# Altium schematic sheet MODULIQ_ADC_10Vpp.SchDoc: ADC 0-10V
size A3; Author: M.Beldyga; CompanyName: WUT ISE; DrawnBy: M.Beldyga; Organization: WUT ISE; Address1: PW ISE; Address2: Nowowiejska 15/19 00-665 Warsaw; Address3: micbeldyga@gmail.com; SheetNumber: 1; SheetTotal: 2; ModifiedBy: -; CheckedDate: -; Title2: MODULIQ; DivGrp: WUT ISE; Designer: M.Beldyga; ModifiedDate: -; ProjectName: Sensor Box
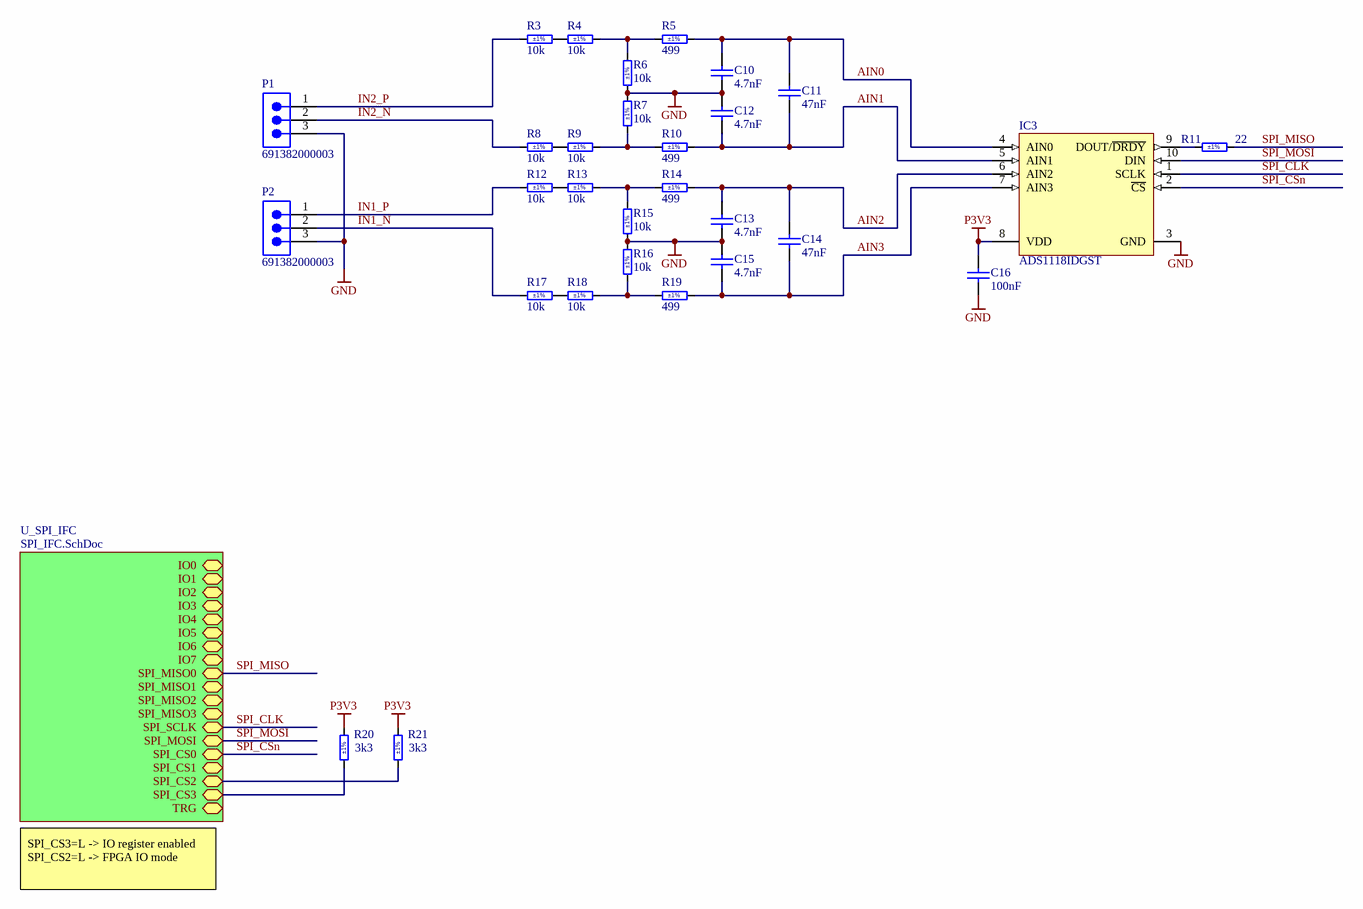
[diagram p0: MODULIQ_ADC_10Vpp.SchDoc]

## Parts
C10  4.7nF  [CAPC1005X55N]
C11  47nF  [CAPC1005X55N]
C12  4.7nF  [CAPC1005X55N]
C13  4.7nF  [CAPC1005X55N]
C14  47nF  [CAPC1005X55N]
C15  4.7nF  [CAPC1005X55N]
C16  100nF  [CAPC1005X55N]
IC3  ADS1118IDGST  [SOP50P490X110-10N]
P1  691382000003  [691382000003]
P2  691382000003  [691382000003]
R3  10k  Tolerance: ±1%  [RESC1005X40N]
R4  10k  Tolerance: ±1%  [RESC1005X40N]
R5  499  Tolerance: ±1%  [RESC1005X40N]
R6  10k  Tolerance: ±1%  [RESC1005X40N]
R7  10k  Tolerance: ±1%  [RESC1005X40N]
R8  10k  Tolerance: ±1%  [RESC1005X40N]
R9  10k  Tolerance: ±1%  [RESC1005X40N]
R10  499  Tolerance: ±1%  [RESC1005X40N]
R11  22  Tolerance: ±1%  [RESC1005X40N]
R12  10k  Tolerance: ±1%  [RESC1005X40N]
R13  10k  Tolerance: ±1%  [RESC1005X40N]
R14  499  Tolerance: ±1%  [RESC1005X40N]
R15  10k  Tolerance: ±1%  [RESC1005X40N]
R16  10k  Tolerance: ±1%  [RESC1005X40N]
R17  10k  Tolerance: ±1%  [RESC1005X40N]
R18  10k  Tolerance: ±1%  [RESC1005X40N]
R19  499  Tolerance: ±1%  [RESC1005X40N]
R20  3k3  Tolerance: ±1%  [RESC1005X40N]
R21  3k3  Tolerance: ±1%  [RESC1005X40N]

## Sub-sheets
U_SPI_IFC = SPI_IFC.SchDoc: IO0 (bidir), IO1 (bidir), IO2 (bidir), IO3 (bidir), IO4 (bidir), IO5 (bidir), IO6 (bidir), IO7 (bidir), SPI_MISO0 (bidir), SPI_MISO1 (bidir), SPI_MISO2 (bidir), SPI_MISO3 (bidir), SPI_SCLK (bidir), SPI_MOSI (bidir), SPI_CS0 (bidir), SPI_CS1 (bidir), SPI_CS2 (bidir), SPI_CS3 (bidir), TRG (bidir)

## Nets
GND: C10.1 C12.2 C13.1 C15.2 C16.1 IC3.3(GND) P1.3 P2.3 R6.1 R7.2 R15.1 R16.2
P3V3: C16.2 IC3.8(VDD) R20.1 R21.1
AIN0: C10.2 C11.2 IC3.4(AIN0) R5.2
AIN1: C11.1 C12.1 IC3.5(AIN1) R10.2
AIN2: C13.2 C14.2 IC3.6(AIN2) R14.2
AIN3: C14.1 C15.1 IC3.7(AIN3) R19.2
IN1_N: P2.2 R17.2
IN1_P: P2.1 R12.2
IN2_N: P1.2 R8.2
IN2_P: P1.1 R3.2
SPI_CLK: IC3.1(SCLK) ; sheet U_SPI_IFC/SPI_SCLK
SPI_CSn: IC3.2(~{CS}) ; sheet U_SPI_IFC/SPI_CS0
SPI_MISO: R11.2 ; sheet U_SPI_IFC/SPI_MISO0
SPI_MOSI: IC3.10(DIN) ; sheet U_SPI_IFC/SPI_MOSI
NetIC3_9: IC3.9(DOUT/~{DRDY}) R11.1
NetR3_1: R3.1 R4.2
NetR4_1: R4.1 R5.1 R6.2
NetR7_1: R7.1 R9.1 R10.1
NetR8_1: R8.1 R9.2
NetR12_1: R12.1 R13.2
NetR13_1: R13.1 R14.1 R15.2
NetR16_1: R16.1 R18.1 R19.1
NetR17_1: R17.1 R18.2
NetR20_2: R20.2 ; sheet U_SPI_IFC/SPI_CS3
NetR21_2: R21.2 ; sheet U_SPI_IFC/SPI_CS2

## Notes on the sheet
- SPI_CS3=L -> IO register enabled
  SPI_CS2=L -> FPGA IO mode
- Project/Equipment
- Document
- Designer
- Drawn by
- Check.by
- Contact
- File
- Last Mod.
- Print Date
- Sheet
- Size
- A3
- of
- Rev

## Library data of the parts
C10 C12 C13 C15 = CC0402_4.7NF_16V_10%_X7R: Non-polarised capacitor; Part Description: SMD Multilayer Chip Ceramic Capacitor; Manufacturer: GENERIC; Manufacturer1 Part Number: 223878715632; Voltage: 16V; TC: X7R; Tolerance: ±10%; Part Number: CC0402_4.7NF_16V_10%_X7R; Component Kind: Standard; Component Type: Standard; Pin Count: 2; Value: 4.7nF; Status: Not Recommended; Manufacturer Part Number: CC0402_4.7NF_16V_10%_X7R; Case: 0402; Mounted: Yes; Socket: No; SMD: Yes; Sense: No; Manufacturer1 Example: PHYCOMP; Manufacturer1 ComponentHeight: 0.55mm; HelpURL: \\cern.ch\dfs\Applications\Altium\Datasheets\CC0402_X7R_PHYCOMP.pdf; Author: CERN DEM JLC; CreateDate: 12/3/2007; LatestRevisionDate: 12/3/2007
C11 C14 = CC0402_47NF_25V_10%_X7R: Non-polarised capacitor; Part Description: SMD Multilayer Chip Ceramic Capacitor; Manufacturer: GENERIC; Manufacturer1 Part Number: C1005X7R1E473K050; Voltage: 25V; TC: X7R; Tolerance: ±10%; Part Number: CC0402_47NF_25V_10%_X7R; Component Kind: Standard; Component Type: Standard; Pin Count: 2; Value: 47nF; Status: Preferred; Manufacturer Part Number: CC0402_47NF_25V_10%_X7R; Case: 0402; Mounted: Yes; Socket: No; SMD: Yes; Sense: No; Manufacturer1 Example: TDK; Manufacturer1 ComponentHeight: 0.55mm; HelpURL: \\cern.ch\dfs\Applications\Altium\Datasheets\CC0402_X7R_TDK_C.pdf; Author: CERN DEM JLC; CreateDate: 10/25/2012; LatestRevisionDate: 10/25/2012
C16 = CC0402_100NF_16V_10%_X7R: Non-polarised capacitor; Part Description: SMD Multilayer Chip Ceramic Capacitor; Manufacturer: GENERIC; Manufacturer1 Part Number: GRM155R71C104KA88D; Voltage: 16V; TC: X7R; Tolerance: ±10%; Part Number: CC0402_100NF_16V_10%_X7R; Component Kind: Standard; Component Type: Standard; Pin Count: 2; Value: 100nF; Status: Not Recommended; Manufacturer Part Number: CC0402_100NF_16V_10%_X7R; Case: 0402; Mounted: Yes; Socket: No; SMD: Yes; Sense: No; Manufacturer1 Example: MURATA; Manufacturer1 ComponentHeight: 0.55mm; HelpURL: \\cern.ch\dfs\Applications\Altium\Datasheets\CC0402_X7R_MURATA_GRM.pdf; Author: CERN DEM JLC; CreateDate: 12/5/2013; LatestRevisionDate: 12/3/2007
IC3 = ADS1118IDGST: Quad Channel Single ADC Delta-Sigma 860sps 16-bit Serial 10-Pin VSSOP T/R; Manufacturer: Texas Instruments; Min Supply Voltage: 2V; Max Supply Voltage: 5.5V; Number of Channels: 2; Max Power Dissipation: 900uW; Operating Supply Voltage: 3.3V; Interface: SPI; Number of Bits: 16; Number of Converters: 1; Resolution: 16b; Sampling Rate: 860S/s; Polarity: Bipolar; Integral Nonlinearity (INL): 1LSB; Number of Inputs: 4; Supply Current: 150uA; Supplier: Mouser; Supplier Part Number: 595-ADS1118IDGST; Manufacturer Part Number: ADS1118IDGST; RoHS: Yes; Category: Analog to Digital Converters (ADCs); Stock: 2422; Pricing: 1=6.29, 10=4.83, 25=4.47, 50=4.47, 100=4.07, 250=3.87, 500=3.69, 1000=3.59, 2500=3.5, 10000=3.59 (USD); Case/Package: VSSOP; Pins: 10; Contact Plating: Gold; Min Operating Temperature: -40°C; Max Operating Temperature: 125°C; Package Quantity: 250; Packaging: Tape and Reel; Number of A/D Converters: 1; Number of Elements: 1; Supply Type: Single; Conversion Rate: 860S/s; Max Supply Voltage (DC): 5.5V; Min Supply Voltage (DC): 2V; Power Dissipation: 900uW; Series: -; Length: 3.1mm; Width: 3.1mm; Height: 1.1mm; Thickness: 1.02mm; Reach SVHC Compliant: No; Lead Free: Lead Free; RoHS Compliant: Yes; ComponentLink1URL: https://datasheet.ciiva.com/7989/1634024-7989312.pdf?src-supplier=Element14; ComponentLink1Description: https://datasheet.ciiva.com/7989/1634024-7989312.pdf?src-supplier=Element14; ComponentLink2URL: https://datasheet.ciiva.com/41461/001186694-da-01-en-ic-adc-16bit-sp-ads1118idgst-msop-10-tid-41461012.pdf?src-supplier=Conrad; ComponentLink2Description: https://datasheet.ciiva.com/41461/001186694-da-01-en-ic-adc-16bit-sp-ads1118idgst-msop-10-tid-41461012.pdf?src-supplier=Conrad; ComponentLink3URL: https://datasheet.ciiva.com/1261/ads1118-1261457.pdf?src-supplier=Digikey; ComponentLink3Description: https://datasheet.ciiva.com/1261/ads1118-1261457.pdf?src-supplier=Digikey; ComponentLink4URL: https://datasheet.ciiva.com/1261/ads1118-1261458.pdf?src-supplier=Digikey; ComponentLink4Description: https://datasheet.ciiva.com/1261/ads1118-1261458.pdf?src-supplier=Digikey; ComponentLink5URL: https://datasheet.ciiva.com/1261/ads1118-1261459.pdf?src-supplier=Digikey; ComponentLink5Description: https://datasheet.ciiva.com/1261/ads1118-1261459.pdf?src-supplier=Digikey; ComponentLink6URL: https://datasheet.ciiva.com/14259/ads1118-14259989.pdf?src-supplier=Avnet; ComponentLink6Description: https://datasheet.ciiva.com/14259/ads1118-14259989.pdf?src-supplier=Avnet; ComponentLink7URL: https://datasheet.ciiva.com/46394/1793017-46394506.pdf?src-supplier=Element14; ComponentLink7Description: https://datasheet.ciiva.com/46394/1793017-46394506.pdf?src-supplier=Element14; ComponentLink8URL: https://datasheet.ciiva.com/46394/1793017-46394507.pdf?src-supplier=Element14; ComponentLink8Description: https://datasheet.ciiva.com/46394/1793017-46394507.pdf?src-supplier=Element14
P1 P2 = 691382000003: WR-TBL Series 382 Vertical PCB Header, THT, pitch 2.5mm, 3p; Manufacturer: Wurth Elektronik; Modularity: No; Rated Current: 4A; Working Voltage: 300V; Manufacturer Part Number: 691382000003; Category: Terminal Blocks; Match Code: WR-TBL; ComponentLink1Description: Website Link; ComponentLink1URL: https://www.we-online.com/redexpert/article/691382000003?ad; ComponentLink2Description: Datasheet Link; ComponentLink2URL: https://www.we-online.com/redexpert/spec/691382000003?ad; Mount: Through Hole; Operating Temperature Max: 105°C; Operating Temperature Min: -40°C; Packaging: Box; Application: Pluggable; Number of Pins: 3; Number of Rows: 1; Orientation: Vertical; Pitch: 2.5mm
R3 R4 R6-R9 R12 R13 R15-R18 = R0402_10K_1%_0.0625W_100PPM: Resistor - 1%; Part Description: General Purpose Thick Film Chip Resistor; Manufacturer: GENERIC; Manufacturer1 Part Number: 232270671003L; TC: ±100ppm/°C; PressFit: No; Part Number: R0402_10K_1%_0.0625W_100PPM; Component Kind: Standard; Component Type: Standard; Pin Count: 2; Value: 10k; Status: Not Recommended; Power: 0.0625W; Manufacturer Part Number: R0402_10K_1%_0.0625W_100PPM; Case: 0402; Mounted: Yes; Sense: No; Socket: No; SMD: Yes; Manufacturer1 Example: YAGEO PHYCOMP; Manufacturer1 ComponentHeight: 0.4mm; HelpURL: \\cern.ch\dfs\Applications\Altium\Datasheets\R0402_Phycomp_RC0402.pdf; Author: CERN DEM JLC; CreateDate: 12/3/2007; LatestRevisionDate: 10/17/2012
R5 R10 R14 R19 = R0402_499R_1%_0.1W_100PPM: Resistor - 1%; Part Description: General Purpose Thick Film Chip Resistor; Manufacturer: GENERIC; Manufacturer1 Part Number: ERJ2RKF4990X; Power: 0.1W; TC: ±100ppm/°C; Voltage: 50V; PressFit: No; Part Number: R0402_499R_1%_0.1W_100PPM; Component Kind: Standard; Component Type: Standard; Pin Count: 2; Value: 499; Status: Not Recommended; Manufacturer Part Number: R0402_499R_1%_0.1W_100PPM; Case: 0402; Mounted: Yes; Sense: No; Socket: No; SMD: Yes; Manufacturer1 Example: PANASONIC; Manufacturer1 ComponentHeight: 0.4mm; HelpURL: \\cern.ch\dfs\Applications\Altium\Datasheets\R0402_PANASONIC_ERJ2RK.pdf; Author: CERN DEM MR; CreateDate: 11/22/2016; LatestRevisionDate: 11/22/2016
R11 = R0402_22R_1%_0.0625W_100PPM: Resistor - 1%; Part Description: General Purpose Thick Film Chip Resistor; Manufacturer: GENERIC; Manufacturer1 Part Number: 232270672209L; TC: ±100ppm/°C; PressFit: No; Part Number: R0402_22R_1%_0.0625W_100PPM; Component Kind: Standard; Component Type: Standard; Pin Count: 2; Value: 22; Status: Not Recommended; Power: 0.0625W; Manufacturer Part Number: R0402_22R_1%_0.0625W_100PPM; Case: 0402; Mounted: Yes; Sense: No; Socket: No; SMD: Yes; Manufacturer1 Example: YAGEO PHYCOMP; Manufacturer1 ComponentHeight: 0.4mm; HelpURL: \\cern.ch\dfs\Applications\Altium\Datasheets\R0402_Phycomp_RC0402.pdf; Author: CERN DEM JLC; CreateDate: 12/3/2007; LatestRevisionDate: 10/17/2012
R20 R21 = R0402_3K3_1%_0.0625W_100PPM: Resistor - 1%; Part Description: General Purpose Thick Film Chip Resistor; Manufacturer: GENERIC; Manufacturer1 Part Number: 232270673302L; TC: ±100ppm/°C; PressFit: No; Part Number: R0402_3K3_1%_0.0625W_100PPM; Component Kind: Standard; Component Type: Standard; Pin Count: 2; Value: 3k3; Status: Not Recommended; Power: 0.0625W; Manufacturer Part Number: R0402_3K3_1%_0.0625W_100PPM; Case: 0402; Mounted: Yes; Sense: No; Socket: No; SMD: Yes; Manufacturer1 Example: YAGEO PHYCOMP; Manufacturer1 ComponentHeight: 0.4mm; HelpURL: \\cern.ch\dfs\Applications\Altium\Datasheets\R0402_Phycomp_RC0402.pdf; Author: CERN DEM JLC; CreateDate: 03.12.2007; LatestRevisionDate: 17.10.2012